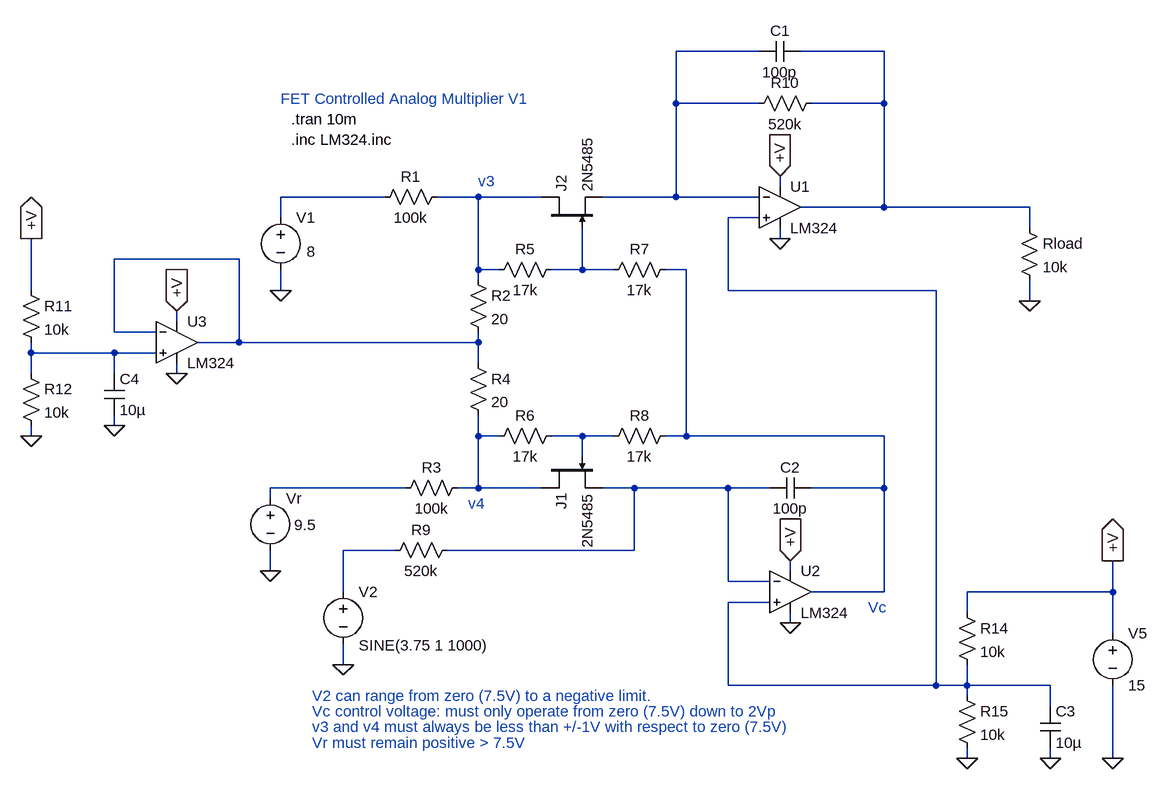
[diagram p0: schematic FET_Controlled_Analog_Multiplier_v1.asc]
FET_Controlled_Analog_Multiplier_v1.asc, the LTspice schematic file:
Version 4
SHEET 1 2336 1060
WIRE 928 -176 800 -176
WIRE 1120 -176 992 -176
WIRE 800 -96 800 -176
WIRE 928 -96 800 -96
WIRE 1120 -96 1120 -176
WIRE 1120 -96 1008 -96
WIRE 960 32 960 16
WIRE 352 48 192 48
WIRE 496 48 432 48
WIRE 592 48 496 48
WIRE 800 48 800 -96
WIRE 800 48 688 48
WIRE 928 48 800 48
WIRE 1120 64 1120 -96
WIRE 1120 64 992 64
WIRE 1344 64 1120 64
WIRE 192 80 192 48
WIRE 928 80 880 80
WIRE 1344 96 1344 64
WIRE 960 112 960 96
WIRE 128 144 -64 144
WIRE 496 160 496 48
WIRE 528 160 496 160
WIRE 656 160 656 96
WIRE 656 160 608 160
WIRE 704 160 656 160
WIRE 816 160 784 160
WIRE 496 176 496 160
WIRE -192 192 -192 112
WIRE 192 192 192 160
WIRE 880 192 880 80
WIRE 1200 192 880 192
WIRE 1344 208 1344 176
WIRE 32 240 32 224
WIRE -64 256 -64 144
WIRE 0 256 -64 256
WIRE 128 272 128 144
WIRE 128 272 64 272
WIRE 496 272 496 256
WIRE 496 272 128 272
WIRE -192 288 -192 272
WIRE -64 288 -192 288
WIRE 0 288 -64 288
WIRE 496 304 496 272
WIRE -192 320 -192 288
WIRE -64 320 -64 288
WIRE 32 320 32 304
WIRE -64 400 -64 384
WIRE -192 416 -192 400
WIRE 496 416 496 384
WIRE 528 416 496 416
WIRE 656 416 608 416
WIRE 704 416 656 416
WIRE 816 416 816 160
WIRE 816 416 784 416
WIRE 1120 416 816 416
WIRE 656 448 656 416
WIRE 384 496 176 496
WIRE 496 496 496 416
WIRE 496 496 464 496
WIRE 592 496 496 496
WIRE 736 496 688 496
WIRE 880 496 736 496
WIRE 944 496 880 496
WIRE 1120 496 1120 416
WIRE 1120 496 1008 496
WIRE 176 512 176 496
WIRE 368 592 288 592
WIRE 736 592 736 496
WIRE 736 592 448 592
WIRE 176 624 176 592
WIRE 976 624 976 608
WIRE 880 640 880 496
WIRE 944 640 880 640
WIRE 288 656 288 592
WIRE 1120 656 1120 496
WIRE 1120 656 1008 656
WIRE 1472 656 1472 608
WIRE 1472 656 1248 656
WIRE 944 672 880 672
WIRE 1248 688 1248 656
WIRE 976 704 976 688
WIRE 1472 720 1472 656
WIRE 288 768 288 736
WIRE 880 800 880 672
WIRE 1200 800 1200 192
WIRE 1200 800 880 800
WIRE 1248 800 1248 768
WIRE 1248 800 1200 800
WIRE 1376 800 1248 800
WIRE 1248 816 1248 800
WIRE 1376 832 1376 800
WIRE 1248 912 1248 896
WIRE 1376 912 1376 896
WIRE 1472 912 1472 800
FLAG 960 16 +V
IOPIN 960 16 In
FLAG 960 112 0
FLAG 976 608 +V
IOPIN 976 608 In
FLAG 976 704 0
FLAG 1248 912 0
FLAG 1376 912 0
FLAG 192 192 0
FLAG 176 624 0
FLAG 288 768 0
FLAG 1472 912 0
FLAG 1472 608 +V
IOPIN 1472 608 Out
FLAG 1344 208 0
FLAG -192 416 0
FLAG -64 400 0
FLAG -192 112 +V
IOPIN -192 112 Out
FLAG 32 224 +V
IOPIN 32 224 In
FLAG 32 320 0
SYMBOL res 1024 -112 R90
WINDOW 0 0 56 VBottom 2
WINDOW 3 32 56 VTop 2
SYMATTR InstName R10
SYMATTR Value 520k
SYMBOL Opamps\\opamp2 960 0 R0
SYMATTR InstName U1
SYMATTR Value LM324
SYMATTR SpiceModel LM324
SYMBOL voltage 192 64 R0
WINDOW 123 0 0 Left 2
WINDOW 39 0 0 Left 2
WINDOW 3 40 68 Left 2
SYMATTR Value 8
SYMATTR InstName V1
SYMBOL Opamps\\opamp2 976 592 R0
SYMATTR InstName U2
SYMATTR Value LM324
SYMATTR SpiceModel LM324
SYMBOL res 448 32 R90
WINDOW 0 0 56 VBottom 2
WINDOW 3 32 56 VTop 2
SYMATTR InstName R1
SYMATTR Value 100k
SYMBOL res 1232 672 R0
SYMATTR InstName R14
SYMATTR Value 10k
SYMBOL res 1232 800 R0
SYMATTR InstName R15
SYMATTR Value 10k
SYMBOL cap 1360 832 R0
SYMATTR InstName C3
SYMATTR Value 10µ
SYMBOL njf 592 448 M90
SYMATTR InstName J1
SYMATTR Value 2N5485
SYMBOL njf 592 96 R270
SYMATTR InstName J2
SYMATTR Value 2N5485
SYMBOL res 480 160 R0
SYMATTR InstName R2
SYMATTR Value 20
SYMBOL res 480 288 R0
SYMATTR InstName R4
SYMATTR Value 20
SYMBOL res 624 144 R90
WINDOW 0 0 56 VBottom 2
WINDOW 3 32 56 VTop 2
SYMATTR InstName R5
SYMATTR Value 17k
SYMBOL res 800 144 R90
WINDOW 0 0 56 VBottom 2
WINDOW 3 32 56 VTop 2
SYMATTR InstName R7
SYMATTR Value 17k
SYMBOL res 624 400 R90
WINDOW 0 0 56 VBottom 2
WINDOW 3 32 56 VTop 2
SYMATTR InstName R6
SYMATTR Value 17k
SYMBOL res 800 400 R90
WINDOW 0 0 56 VBottom 2
WINDOW 3 32 56 VTop 2
SYMATTR InstName R8
SYMATTR Value 17k
SYMBOL res 480 480 R90
WINDOW 0 0 56 VBottom 2
WINDOW 3 32 56 VTop 2
SYMATTR InstName R3
SYMATTR Value 100k
SYMBOL res 464 576 R90
WINDOW 0 0 56 VBottom 2
WINDOW 3 32 56 VTop 2
SYMATTR InstName R9
SYMATTR Value 520k
SYMBOL cap 1008 480 R90
WINDOW 0 0 32 VBottom 2
WINDOW 3 32 32 VTop 2
SYMATTR InstName C2
SYMATTR Value 100p
SYMBOL voltage 176 496 R0
WINDOW 123 0 0 Left 2
WINDOW 39 0 0 Left 2
WINDOW 3 37 57 Left 2
SYMATTR Value 9.5
SYMATTR InstName Vr
SYMBOL voltage 288 640 R0
WINDOW 123 0 0 Left 2
WINDOW 39 0 0 Left 2
WINDOW 3 24 98 Left 2
SYMATTR Value SINE(3.75 1 1000)
SYMATTR InstName V2
SYMBOL voltage 1472 704 R0
WINDOW 123 0 0 Left 2
WINDOW 39 0 0 Left 2
SYMATTR InstName V5
SYMATTR Value 15
SYMBOL res 1328 80 R0
SYMATTR InstName Rload
SYMATTR Value 10k
SYMBOL cap 928 -160 R270
WINDOW 0 32 32 VTop 2
WINDOW 3 0 32 VBottom 2
SYMATTR InstName C1
SYMATTR Value 100p
SYMBOL res -208 176 R0
SYMATTR InstName R11
SYMATTR Value 10k
SYMBOL res -208 304 R0
SYMATTR InstName R12
SYMATTR Value 10k
SYMBOL cap -80 320 R0
SYMATTR InstName C4
SYMATTR Value 10µ
SYMBOL Opamps\\opamp2 32 208 R0
SYMATTR InstName U3
SYMATTR Value LM324
SYMATTR SpiceModel LM324
TEXT 208 -72 Left 2 !.tran 10m
TEXT 384 -88 Bottom 2 ;FET Controlled Analog Multiplier V1
TEXT 208 -40 Left 2 !.inc LM324.inc
TEXT 240 816 Left 2 ;V2 can range from zero (7.5V) to a negative limit.
TEXT 1096 680 Left 2 ;Vc
TEXT 240 888 Left 2 ;Vr must remain positive > 7.5V
TEXT 496 24 Left 2 ;v3
TEXT 480 520 Left 2 ;v4
TEXT 240 840 Left 2 ;Vc control voltage: must only operate from zero (7.5V) down to 2Vp
TEXT 240 864 Left 2 ;v3 and v4 must always be less than +/-1V with respect to zero (7.5V)

The netlist it stands for:
* FET_Controlled_Analog_Multiplier_v1.asc
R10 N002 N001 520k
XU1 N005 N001 +V 0 N002 LM324 LM324  ; pins In+ In- V+ V- OUT
V1 N003 0 8
XU2 N005 N013 +V 0 N008 LM324 LM324  ; pins In+ In- V+ V- OUT
R1 N004 N003 100k
R14 +V N005 10k
R15 N005 0 10k
C3 N005 0 10µ
J1 N010 N011 N013 2N5485
J2 N004 N007 N001 2N5485
R2 N004 N006 20
R4 N006 N010 20
R5 N007 N004 17k
R7 N008 N007 17k
R6 N011 N010 17k
R8 N008 N011 17k
R3 N010 N012 100k
R9 N013 N014 520k
C2 N008 N013 100p
Vr N012 0 9.5
V2 N014 0 SINE(3.75 1 1000)
V5 +V 0 15
Rload N002 0 10k
C1 N001 N002 100p
R11 +V N009 10k
R12 N009 0 10k
C4 N009 0 10µ
XU3 N009 N006 +V 0 N006 LM324 LM324  ; pins In+ In- V+ V- OUT
.model NJF NJF
.model PJF PJF
.lib standard.jft
.tran 10m
* FET Controlled Analog Multiplier V1
.inc LM324.inc
* V2 can range from zero (7.5V) to a negative limit.
* Vc
* Vr must remain positive > 7.5V
* v3
* v4
* Vc control voltage: must only operate from zero (7.5V) down to 2Vp
* v3 and v4 must always be less than +/-1V with respect to zero (7.5V)
.backanno
.end